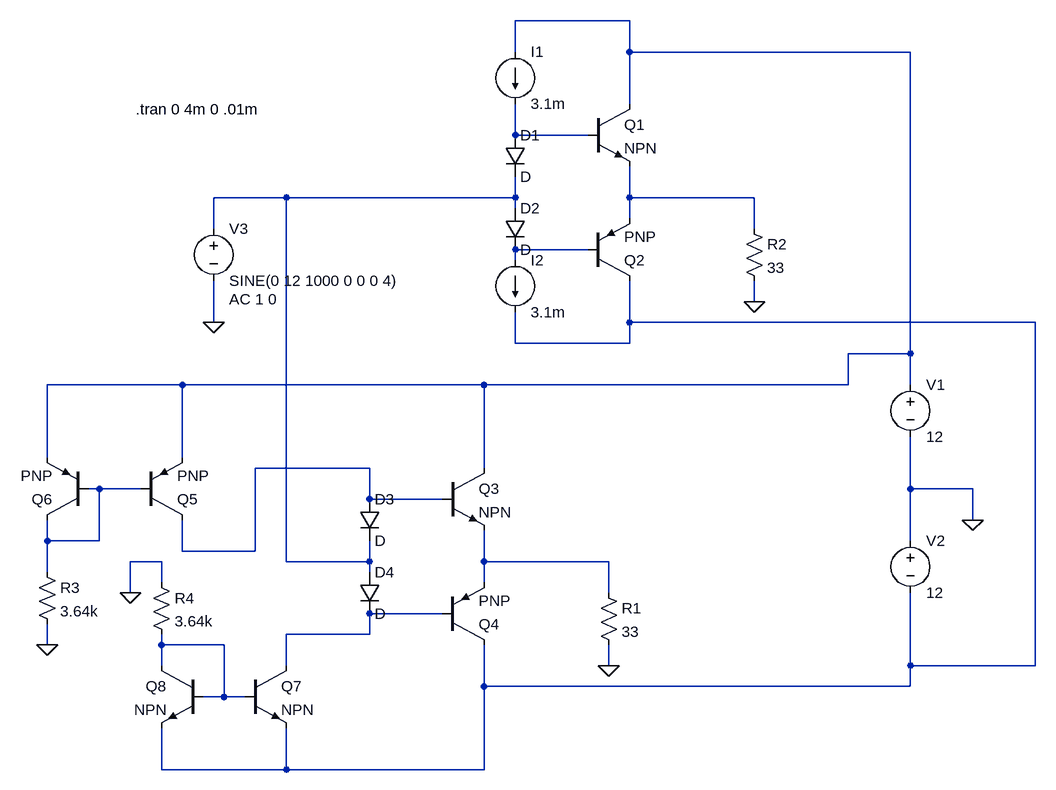
[diagram p0: schematic claseab tension.asc]
claseab tension.asc, the LTspice schematic file:
Version 4
SHEET 1 884 680
WIRE 256 -560 80 -560
WIRE 80 -512 80 -560
WIRE 256 -512 256 -560
WIRE 688 -512 256 -512
WIRE 256 -432 256 -512
WIRE 80 -384 80 -432
WIRE 192 -384 80 -384
WIRE -272 -288 -384 -288
WIRE 80 -288 80 -320
WIRE 80 -288 -272 -288
WIRE 256 -288 256 -336
WIRE 448 -288 256 -288
WIRE 80 -272 80 -288
WIRE 256 -256 256 -288
WIRE -384 -240 -384 -288
WIRE 448 -240 448 -288
WIRE 192 -208 80 -208
WIRE 80 -192 80 -208
WIRE 448 -128 448 -160
WIRE -384 -96 -384 -160
WIRE 256 -96 256 -160
WIRE 880 -96 256 -96
WIRE 80 -64 80 -112
WIRE 256 -64 256 -96
WIRE 256 -64 80 -64
WIRE 688 -48 688 -512
WIRE 688 -48 592 -48
WIRE -432 0 -640 0
WIRE 32 0 -432 0
WIRE 592 0 592 -48
WIRE 592 0 32 0
WIRE 688 0 688 -48
WIRE -640 112 -640 0
WIRE -432 112 -432 0
WIRE -144 128 -320 128
WIRE 32 128 32 0
WIRE -560 160 -576 160
WIRE -496 160 -560 160
WIRE 688 160 688 80
WIRE 784 160 688 160
WIRE -144 176 -144 128
WIRE -32 176 -144 176
WIRE 784 208 784 160
WIRE -640 240 -640 208
WIRE -560 240 -560 160
WIRE -560 240 -640 240
WIRE 688 240 688 160
WIRE -432 256 -432 208
WIRE -320 256 -320 128
WIRE -320 256 -432 256
WIRE -464 272 -512 272
WIRE -272 272 -272 -288
WIRE -144 272 -144 240
WIRE -144 272 -272 272
WIRE 32 272 32 224
WIRE 224 272 32 272
WIRE -640 288 -640 240
WIRE -144 288 -144 272
WIRE -464 304 -464 272
WIRE 32 304 32 272
WIRE -512 320 -512 272
WIRE 224 320 224 272
WIRE -32 352 -144 352
WIRE -144 384 -144 352
WIRE -144 384 -272 384
WIRE -640 400 -640 368
WIRE -464 400 -464 384
WIRE -368 400 -464 400
WIRE -464 432 -464 400
WIRE -272 432 -272 384
WIRE 224 432 224 400
WIRE 688 432 688 320
WIRE 880 432 880 -96
WIRE 880 432 688 432
WIRE 32 464 32 400
WIRE 688 464 688 432
WIRE 688 464 32 464
WIRE -368 480 -368 400
WIRE -368 480 -400 480
WIRE -336 480 -368 480
WIRE -464 592 -464 528
WIRE -272 592 -272 528
WIRE -272 592 -464 592
WIRE 32 592 32 464
WIRE 32 592 -272 592
FLAG 784 208 0
FLAG -384 -96 0
FLAG 448 -128 0
FLAG 224 432 0
FLAG -640 400 0
FLAG -512 320 0
SYMBOL voltage 688 -16 R0
WINDOW 123 0 0 Left 2
WINDOW 39 0 0 Left 2
SYMATTR InstName V1
SYMATTR Value 12
SYMBOL voltage 688 224 R0
WINDOW 123 0 0 Left 2
WINDOW 39 0 0 Left 2
SYMATTR InstName V2
SYMATTR Value 12
SYMBOL voltage -384 -256 R0
WINDOW 123 24 124 Left 2
WINDOW 39 0 0 Left 2
SYMATTR Value2 AC 1 0
SYMATTR InstName V3
SYMATTR Value SINE(0 12 1000 0 0 0 4)
SYMBOL diode 64 -384 R0
SYMATTR InstName D1
SYMBOL diode 64 -272 R0
SYMATTR InstName D2
SYMBOL res 432 -256 R0
SYMATTR InstName R2
SYMATTR Value 33
SYMBOL current 80 -512 R0
WINDOW 123 0 0 Left 2
WINDOW 39 0 0 Left 2
SYMATTR InstName I1
SYMATTR Value 3.1m
SYMBOL current 80 -192 R0
WINDOW 123 0 0 Left 2
WINDOW 39 0 0 Left 2
SYMATTR InstName I2
SYMATTR Value 3.1m
SYMBOL npn 192 -432 R0
SYMATTR InstName Q1
SYMBOL pnp 192 -160 M180
SYMATTR InstName Q2
SYMBOL diode -160 176 R0
SYMATTR InstName D3
SYMBOL diode -160 288 R0
SYMATTR InstName D4
SYMBOL res 208 304 R0
SYMATTR InstName R1
SYMATTR Value 33
SYMBOL npn -32 128 R0
SYMATTR InstName Q3
SYMBOL pnp -32 400 M180
SYMATTR InstName Q4
SYMBOL pnp -496 208 M180
SYMATTR InstName Q5
SYMBOL pnp -576 208 R180
SYMATTR InstName Q6
SYMBOL res -656 272 R0
SYMATTR InstName R3
SYMATTR Value 3.64k
SYMBOL npn -336 432 R0
SYMATTR InstName Q7
SYMBOL npn -400 432 M0
SYMATTR InstName Q8
SYMBOL res -480 288 R0
SYMATTR InstName R4
SYMATTR Value 3.64k
TEXT -504 -424 Left 2 !.tran 0 4m 0 .01m

The netlist it stands for:
* claseab tension.asc
V1 N001 0 12
V2 0 N006 12
V3 N003 0 SINE(0 12 1000 0 0 0 4) AC 1 0
D1 N002 N003 D
D2 N003 N005 D
R2 N004 0 33
I1 N001 N002 3.1m
I2 N005 N006 3.1m
Q1 N001 N002 N004 0 NPN
Q2 N006 N005 N004 0 PNP
D3 N007 N003 D
D4 N003 N010 D
R1 N009 0 33
Q3 N001 N007 N009 0 NPN
Q4 N006 N010 N009 0 PNP
Q5 N007 N008 N001 0 PNP
Q6 N008 N008 N001 0 PNP
R3 N008 0 3.64k
Q7 N010 N011 N006 0 NPN
Q8 N011 N011 N006 0 NPN
R4 0 N011 3.64k
.model D D
.lib standard.dio
.model NPN NPN
.model PNP PNP
.lib standard.bjt
.tran 0 4m 0 .01m
.backanno
.end